# EAGLE design 12A-03 (EAGLE 6.3)
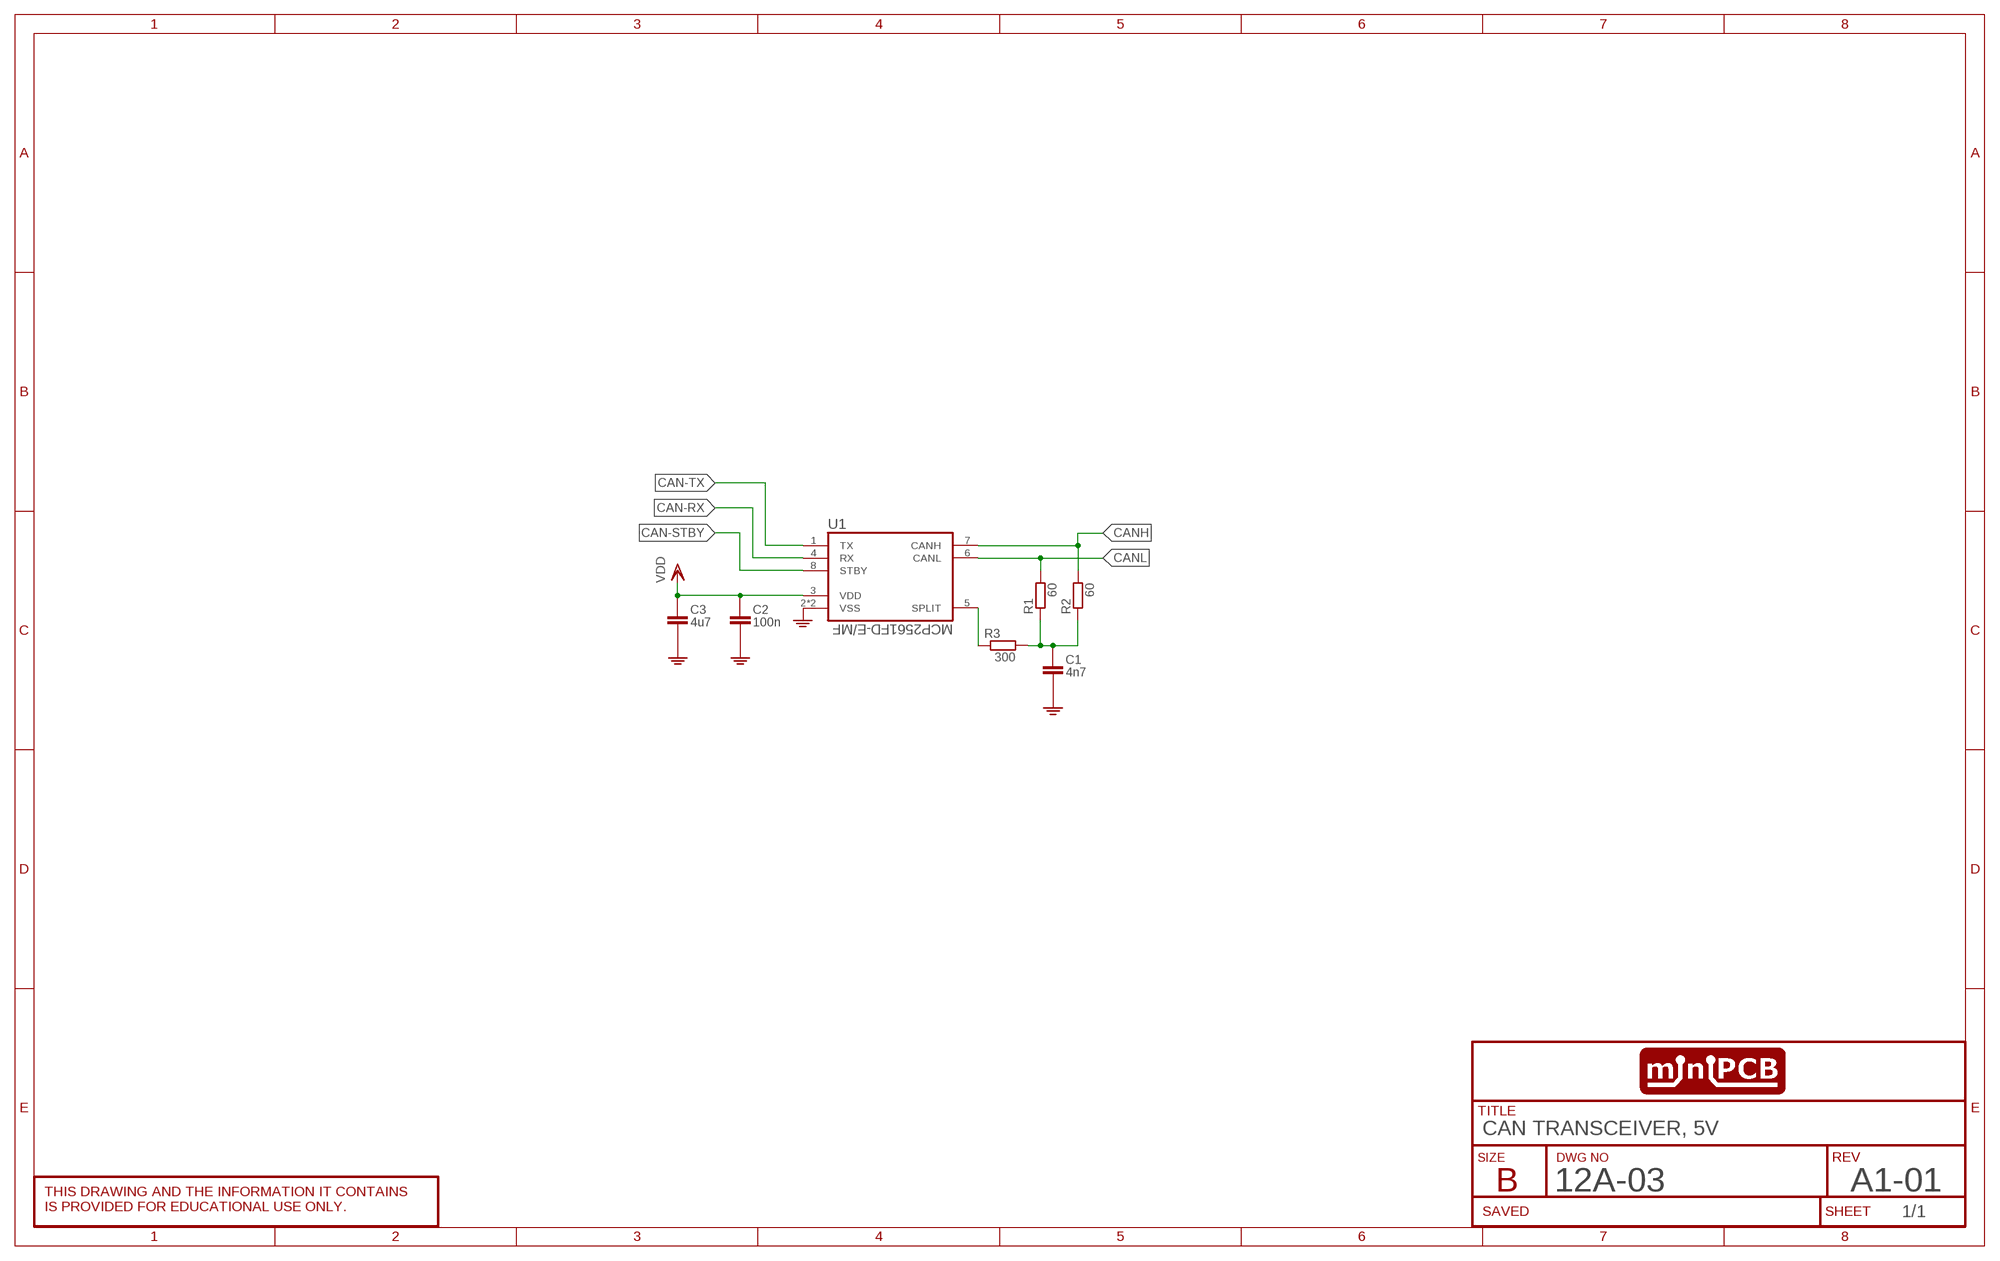
[diagram p0: schematic, sheet 1]
SHEET1 (SCHEMATIC): DWG_NO: 12A-03; REV: A1-01; TITLE: CAN TRANSCEIVER, 5V

## Parts
C1  4n7  CAPACITOR0402  [C0402]
C2  100n  CAPACITOR0402  [C0402]
C3  4u7  CAPACITOR0402  [C0402]
R1  60  RESISTOR0402  [R0402]
R2  60  RESISTOR0402  [R0402]
R3  300  RESISTOR0402  [R0402]
U1  MCP2561FD-E/MF  [SON65P300X300X100-9N]

## Nets
CAN-RX: U1.4(RX)
CAN-STBY: U1.8(STBY)
CAN-TX: U1.1(TX)
CANH: R2.2 U1.7(CANH)
CANL: R1.2 U1.6(CANL)
GND: C1.2(-) C2.2(-) C3.2(-) U1.2(VSS) U1.9(VSS)
N$1: R3.1 U1.5(SPLIT)
N$4: C1.1(+) R1.1 R2.1 R3.2
VDD: C2.1(+) C3.1(+) U1.3(VDD)

## Library data of the parts
C1-C3 = minipcb:CAPACITOR
R1-R3 = minipcb:RESISTOR
U1 = utsa:MCP2561FD-E/MF

## Board
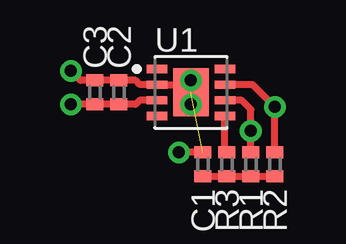
[diagram p1: board, top side]

No outline drawn. Coordinates in mm, seen from the top.
Copper layers (1*16): Top 0.035mm / dielectric 1.5mm / Bottom 0.035mm
Design rules "default": minimum track width 10mil, minimum drill 0.6mm, track to track 8mil, track to pad 8mil, pad to pad 8mil, via to via 8mil, smd to smd 8mil, copper to edge 40mil, drill to drill 8mil, minimum pad ring 10mil, minimum via ring 8mil, stop-mask expansion 4mil, vias tented up to drill 0mil, thermal gap 10mil

### Footprints (pad centres in the part's own frame; a part is rotated, then mirrored left to right if it is on the bottom)
C0402 = smd 0.5 x 0.7: 1 -0.5,0; 2 0.5,0
R0402 = smd 0.5 x 0.7: 1 -0.5,0; 2 0.5,0
SON65P300X300X100-9N = smd 0.87 x 0.32: 1 -1.42,0.975; 2 -1.42,0.325; 3 -1.42,-0.325; 4 -1.42,-0.975; 5 1.42,-0.975; 6 1.42,-0.325; 7 1.42,0.325; 8 1.42,0.975 | smd 1.47 x 2: 9 0,0

### Placement (x,y rotation side)
C1  0.5,-3 90 top
C2  -3,0 90 top
C3  -4,0 90 top
R1  2.5,-3 90 top
R2  3.5,-3 90 top
R3  1.5,-3 270 top
U1  0,0 0 top

### Tracks (layer width: path | path; a pad name or v marks a point on that pad's centre or on a via)
CANH  (via drill 0.5)
  Top 0.3: R2.2 v3.5,-0.6 2.58,0.33 U1.7
CANL  (via drill 0.5)
  Top 0.3: R1.2 v2.5,-1.6 2.5,-0.7 2.12,-0.33 U1.6
GND  (via drill 0.5)  (1 unrouted)
  Top 0.3: U1.9 -0.33,0.33 U1.2 -2.12,0.33 -2.3,0.5 C2.2 C3.2 -4.6,0.5 v-5,0.9 | C1.2 v-0.5,-2.5
N$1
  Top 0.3: R3.1 1.42,-2.42 U1.5
N$2  (via drill 0.5)
  other vias: 0,0.5
N$3  (via drill 0.5)
  other vias: 0,-0.5
N$4
  Top 0.3: R2.1 R1.1 R3.2 C1.1
VDD  (via drill 0.5)
  Top 0.3: U1.3 -2.12,-0.33 -2.3,-0.5 C2.1 C3.1 v-5,-0.5